# EAGLE design rtcdot-ds1307-r1 (EAGLE 5.11)
DIGIKEY: 300-8761-ND
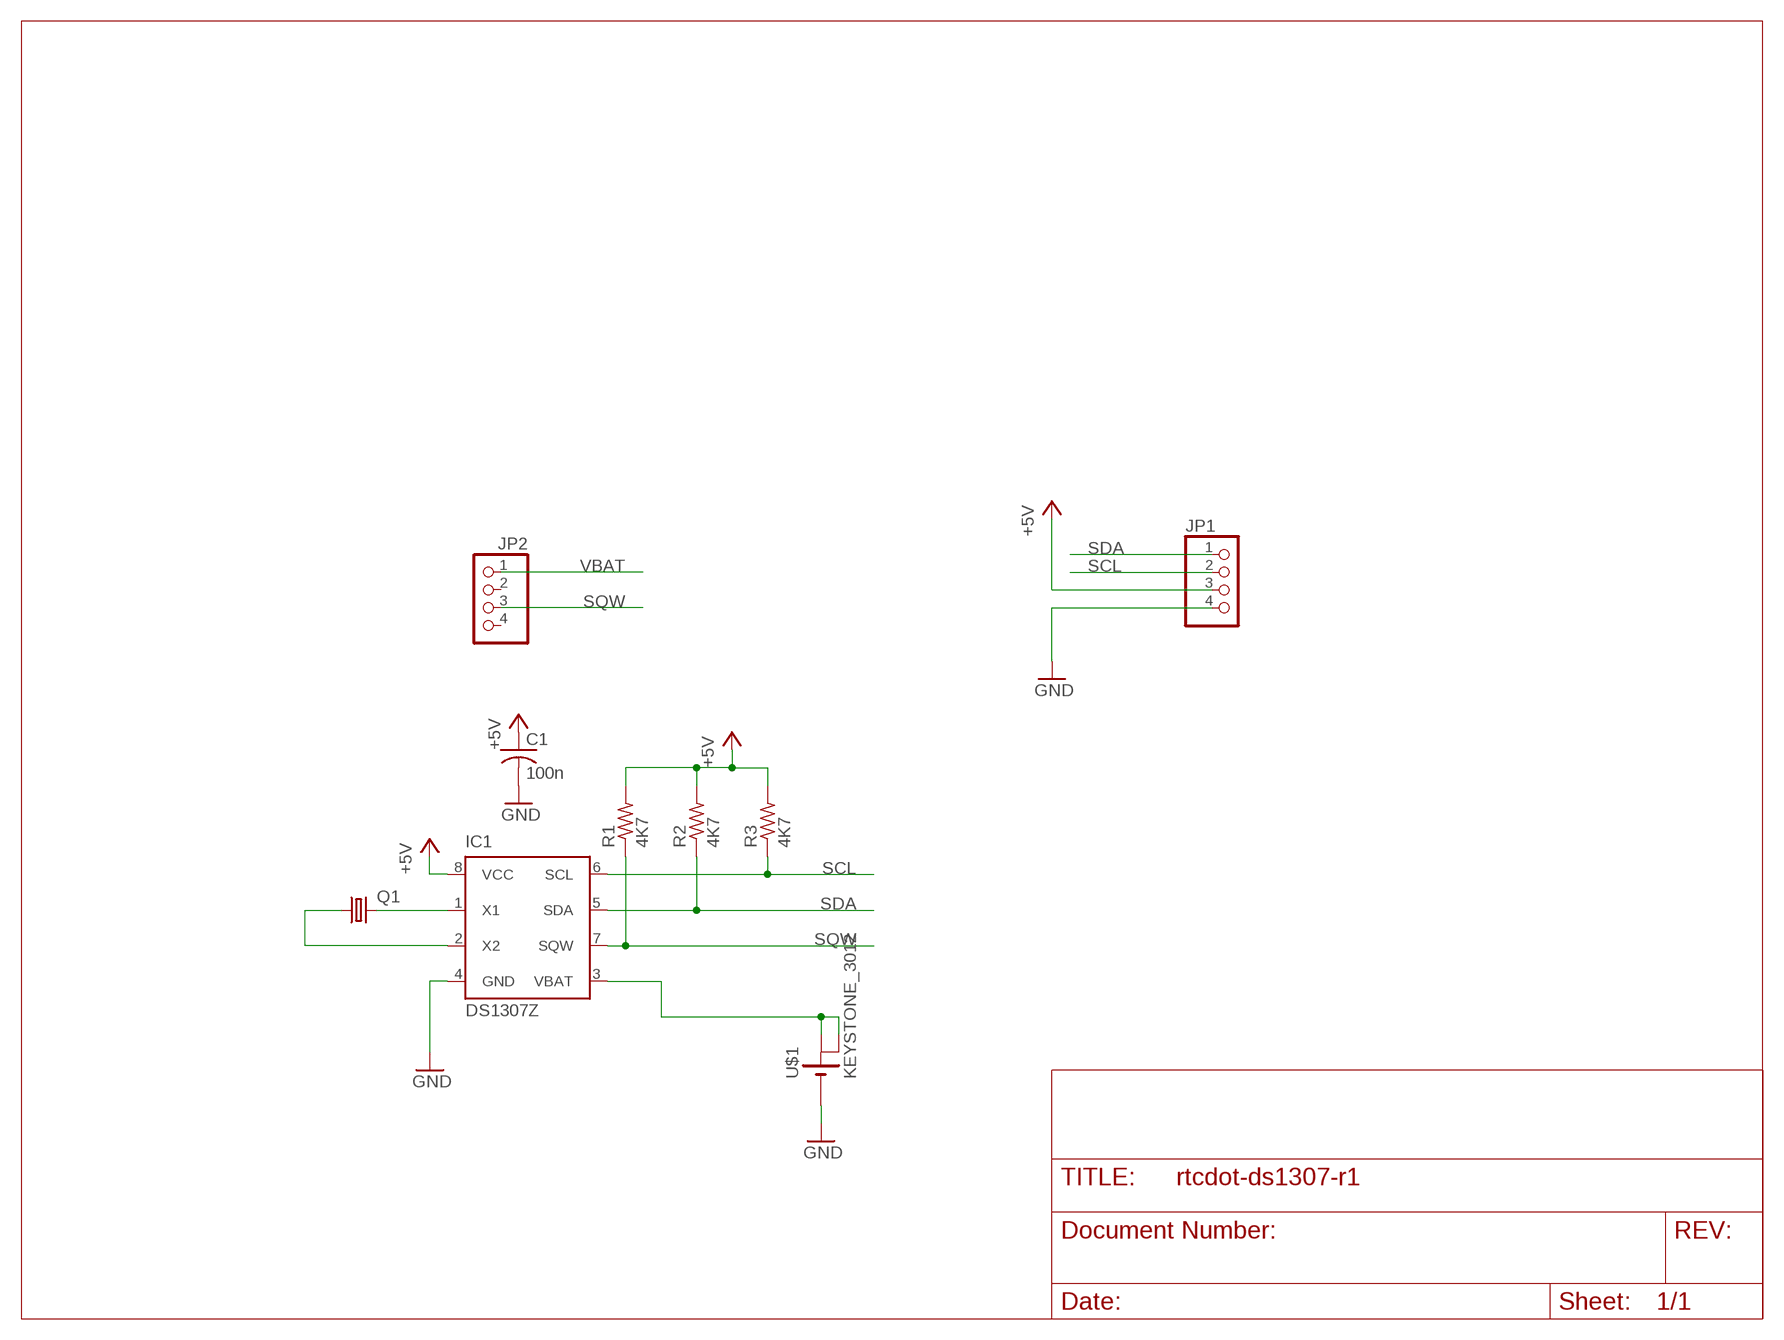
[diagram p0: schematic, sheet 1]

## Parts
C1  100n  C-USC0603  [C0603]
IC1  DS1307Z  [SOIC8]
JP1  PINHD-1X4  [1X04]
JP2  PINHD-1X4  [1X04]
Q1  CRYSTALTC26H  [TC26H]
R1  4K7  R-US_R0603  [R0603]
R2  4K7  R-US_R0603  [R0603]
R3  4K7  R-US_R0603  [R0603]
U$1  KEYSTONE_3012  [KEYSTONE_3012]

## Nets
+5V: C1.1 IC1.8(VCC) JP1.3 R1.2 R2.2 R3.2
GND: C1.2 IC1.4(GND) JP1.4 U$1.BAT-(-2)
N$37: IC1.2(X2) Q1.1
N$55: IC1.1(X1) Q1.2
SCL: IC1.6(SCL) JP1.2 R3.1
SDA: IC1.5(SDA) JP1.1 R2.1
SQW: IC1.7(SQW) JP2.3 R1.1
VBAT: IC1.3(VBAT) JP2.1 U$1.BAT+1(+1) U$1.BAT+2(+2)
Unconnected: JP2.2 JP2.4

## Library data of the parts
C1 = rcl:C-US: CAPACITOR, American symbol
IC1 = ds1307_pcf8583:DS1307: I2C-Bus CLOCK/CALENDAR
JP1 JP2 = pinhead:PINHD-1X4: PIN HEADER
Q1 = crystal:CRYSTAL: CRYSTAL; OC_FARNELL: unknown; OC_NEWARK: unknown
R1-R3 = rcl:R-US_: RESISTOR, American symbol
U$1 = macetech:KEYSTONE_3012

## Board
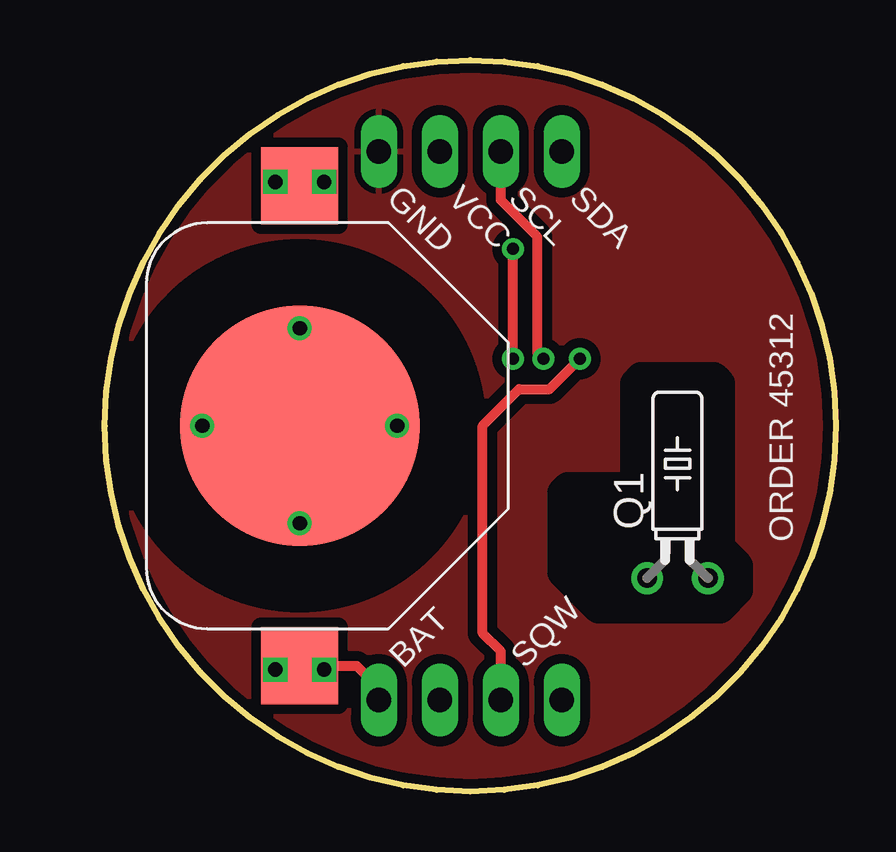
[diagram p1: board, top side]
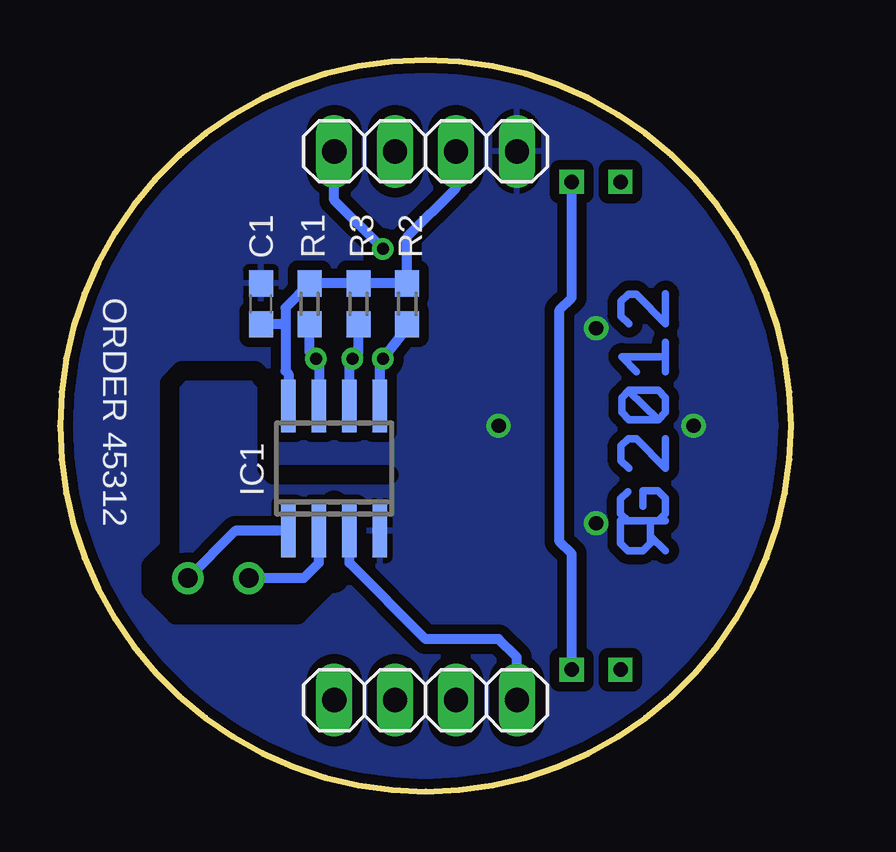
[diagram p2: board, bottom side, seen from below]

Size 30.48 x 30.48 mm. Coordinates in mm from the lower left corner, seen from the top.
Outline: 15.24,30.48 arc-90 30.48,15.24 arc-90 15.24,0 arc-90 0,15.24 arc-90 15.24,30.48
Copper layers (1*16): Top 0.035mm / dielectric 1.5mm / Bottom 0.035mm
Design rules "default *": minimum track width 10mil, minimum drill 19mil, track to track 8mil, track to pad 8mil, pad to pad 8mil, via to via 8mil, smd to smd 8mil, copper to edge 10mil, drill to drill 8mil, minimum pad ring 10mil, minimum via ring 8mil, stop-mask expansion 4mil, vias tented up to drill 25mil, thermal gap 10mil
tRestrict: area 0.8,7.9 to 15.5,22.6; 14 lines
bRestrict: 14 lines
Milling: 4 lines

### Footprints (pad centres in the part's own frame; a part is rotated, then mirrored left to right if it is on the bottom)
C0603 = smd 1.1 x 1: 1 -0.85,0; 2 0.85,0
SOIC8 = smd 0.6 x 2.2: 1 -1.905,-2.6; 2 -0.635,-2.6; 3 0.635,-2.6; 4 1.905,-2.6; 5 1.905,2.6; 6 0.635,2.6; 7 -0.635,2.6; 8 -1.905,2.6
1X04 = drill 1.016 long: 1 -3.81,0; 2 -1.27,0; 3 1.27,0; 4 3.81,0
TC26H = drill 0.813 round: 1 -1.27,0; 2 1.27,0
R0603 = smd 1.1 x 1: 1 -0.85,0; 2 0.85,0
KEYSTONE_3012 = smd 3.2 x 3.2: BAT+1 -10,0; BAT+2 10,0 | smd 10 x 10: BAT- 0,0

### Placement (x,y rotation side)
C1  22.1,20.32 90 bottom
IC1  19.05,13.46 0 bottom
JP1  15.24,26.67 0 bottom
JP2  15.24,3.81 180 bottom
Q1  23.88,8.89 0 top
R1  20.07,20.32 90 bottom
R2  16,20.32 90 bottom
R3  18.03,20.32 90 bottom
U$1  8.13,15.24 90 top
U$2  [RGLOGO_SMALL_2012]  5.08,11.43 90 bottom

### Tracks (layer width: path | path; a pad name or v marks a point on that pad's centre or on a via)
+5V
  Bottom 0.406: IC1.8 20.95,17.4 21.08,17.53 21.08,19.56 | 21.08,19.56 21.08,20.15 R1.2 R3.2 R2.2 16,23.11 13.97,25.15 JP1.3 | C1.1 21.17,19.47 21.08,19.56
GND  (via drill 0.6)
  Top 0.406: v8.13,11.18 U$1.BAT-
  other vias: 8.13,19.3 4.06,15.24 12.19,15.24
  pour Top (isolate 0.406): 15.24,30.48 arc-90 30.48,15.24 arc-90 15.24,0 arc-90 0,15.24 arc-90
  pour Bottom (isolate 0.406): 0,15.24 arc-91 15.24,30.48 arc-90 30.48,15.24 arc-90 15.24,0 arc-90
N$37
  Bottom 0.406: IC1.2 19.68,9.53 20.32,8.89 Q1.1
N$55
  Bottom 0.406: IC1.1 23.17,10.86 Q1.2
SCL  (via drill 0.5)
  Top 0.406: JP1.2 16.51,24.64 18.03,23.11 R3.1 18.03,18.29 v18.29,18.03
  Bottom 0.406: IC1.6 18.41,17.91 v18.29,18.03 18.03,18.29 R3.1
SDA  (via drill 0.5)
  Top 0.406: v17.02,18.03 v17.02,22.61
  Bottom 0.406: JP1.1 19.05,24.64 v17.02,22.61 | IC1.5 17.14,17.91 v17.02,18.03 16,19.3 R2.1
SQW  (via drill 0.5)
  Top 0.406: v19.81,18.03 18.54,16.76 17.27,16.76 15.75,15.24 15.75,6.6 16.51,5.84 JP2.3
  Bottom 0.406: IC1.7 19.68,17.91 v19.81,18.03 20.07,18.29 R1.1
VBAT  (via drill 0.6)
  Top 0.406: U$1.BAT+1 10.51,5.24 11.43,4.32 JP2.1 | v7.11,25.4 v9.14,25.4 8.29,25.4 U$1.BAT+2 | v9.14,5.08 8.29,5.08 U$1.BAT+1 | v7.11,5.08 7.97,5.08 U$1.BAT+1
  Bottom 0.406: IC1.3 18.41,9.53 15.24,6.35 12.19,6.35 11.43,5.59 JP2.1 | v9.14,5.08 9.14,9.91 9.65,10.41 9.65,20.07 9.14,20.57 v9.14,25.4

### Text on the board
tNames: GND | VCC | SCL | SDA | ORDER 45312 | BAT | SQW
bNames: ORDER 45312